# EAGLE design pixel-adapter (EAGLE 7.7.0)
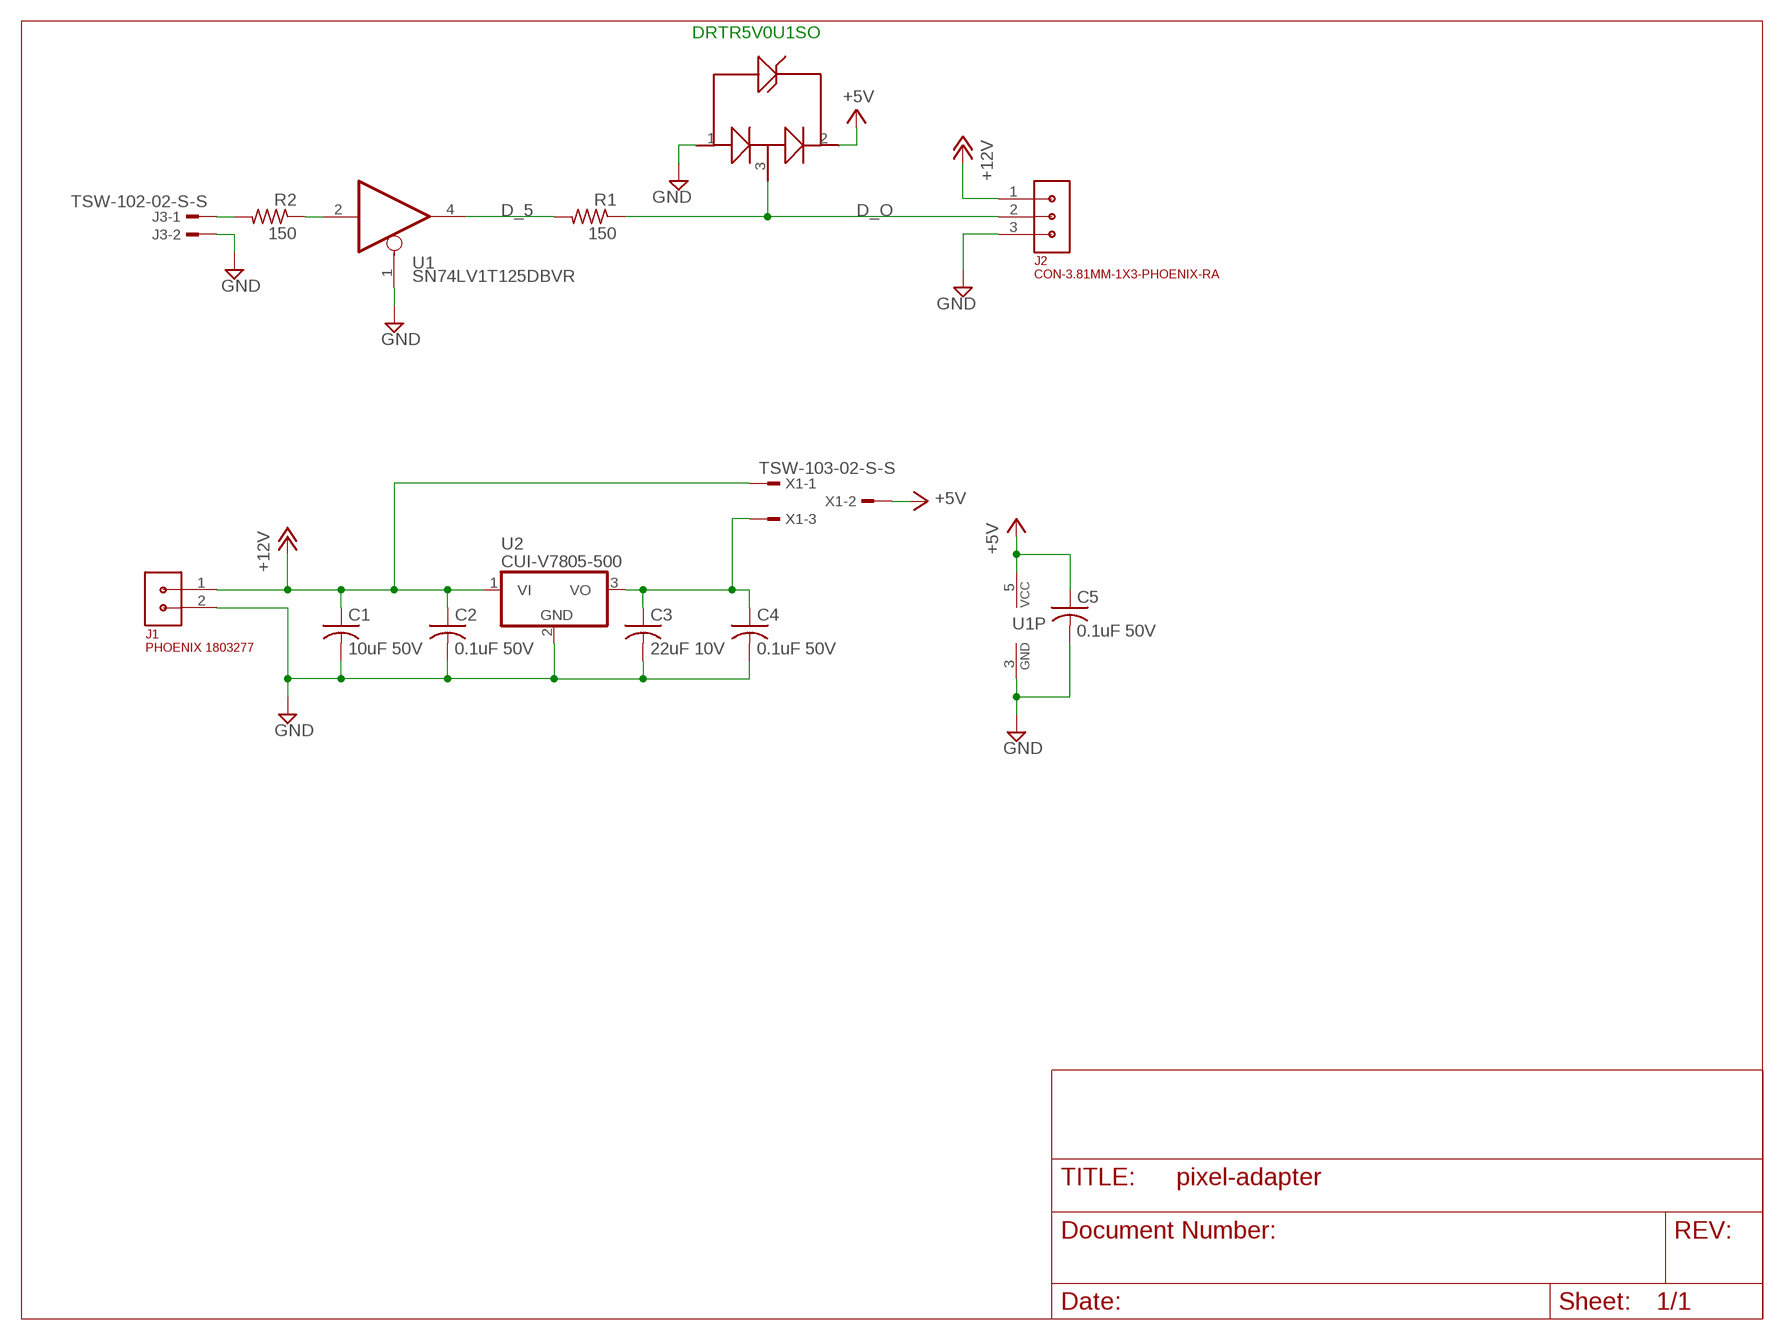
[diagram p0: schematic, sheet 1]

## Parts
C1  10uF 50V  C-USC1210K  [C1210K]
C2  0.1uF 50V  C-USC1206  [C1206]
C3  22uF 10V  C-USC1206K  [C1206K]
C4  0.1uF 50V  C-USC1206  [C1206]
C5  0.1uF 50V  C-USC0603K  [C0603K]
D1  DRTR5V0U1SO  [SOT23-3]
J1  PHOENIX 1803277  CON-3.81MM-1X2-PHOENIX  [CON-PHOENIX-3.81-1X2-RA]
J2  CON-3.81MM-1X3-PHOENIX-RA  [CON-PHOENIX-3.81-1X3-RA]
J3  TSW-102-02-S-S  [TSW-102-02-S-S]
R1  150  R-US_M1206  [M1206]
R2  150  R-US_M1206  [M1206]
U1  SN74LV1T125DBVR  74AHC1G125DBV  [SOT23-5]
U2  CUI-V7805-500  CUI-V7803-500  [CUI-78XX-500]
X1  TSW-103-02-S-S  [TSW-103-02-S-S]

## Nets
+5V: C5.1 D1.2 U1.5(VCC) X1.2
+12V: C1.1 C2.1 J1.1 J2.1 U2.1(VI) X1.1
D_5: R1.2 U1.4(O)
D_O: D1.3 J2.2 R1.1
DIN: J3.1 R2.2
DIN_O: R2.1 U1.2(I)
GND: C1.2 C2.2 C3.2 C4.2 C5.2 D1.1 J1.2 J2.3 J3.2 U1.1(OE) U1.3(GND) U2.2(GND)
VREG: C3.1 C4.1 U2.3(VO) X1.3

## Notes on the sheet
- DRTR5V0U1SO

## Library data of the parts
C1 = rcl:C-US: CAPACITOR, American symbol; MFR: KEMET; MFR_PART_NO: C1210C106K5RACTU
C2 C4 C5 = rcl:C-US: CAPACITOR, American symbol; MFR: KEMET; MFR_PART_NO: C1206S104M5RACTU
C3 = rcl:C-US: CAPACITOR, American symbol; MFR: KEMET; MFR_PART_NO: C1206C226K8RAC7800
D1 = GlenPartsLibrary:DRTR5V0U1SO
J1 = 0GlenConnectors:CON-3.81MM-1X2-PHOENIX
J2 = 0GlenConnectors:CON-3.81MM-1X3-PHOENIX-RA
J3 = con-samtec:TSW-102-02-S-S: THROUGH-HOLE .025" SQ POST HEADER Source: Samtec TSW.pdf; OC_FARNELL: unknown; OC_NEWARK: unknown
R1 R2 = rcl:R-US_: RESISTOR, American symbol
U1 = 74xx-little-us:74*1G125: Single Bus Buffer Gate with 3-State Output; MFR: TI; MFR_PART_NO: SN74LV1T125DBVR
U2 = GlenPartsLibrary:CUI-V7803-500
X1 = con-samtec:TSW-103-02-S-S: THROUGH-HOLE .025" SQ POST HEADER Source: Samtec TSW.pdf; OC_FARNELL: unknown; OC_NEWARK: unknown

## Board
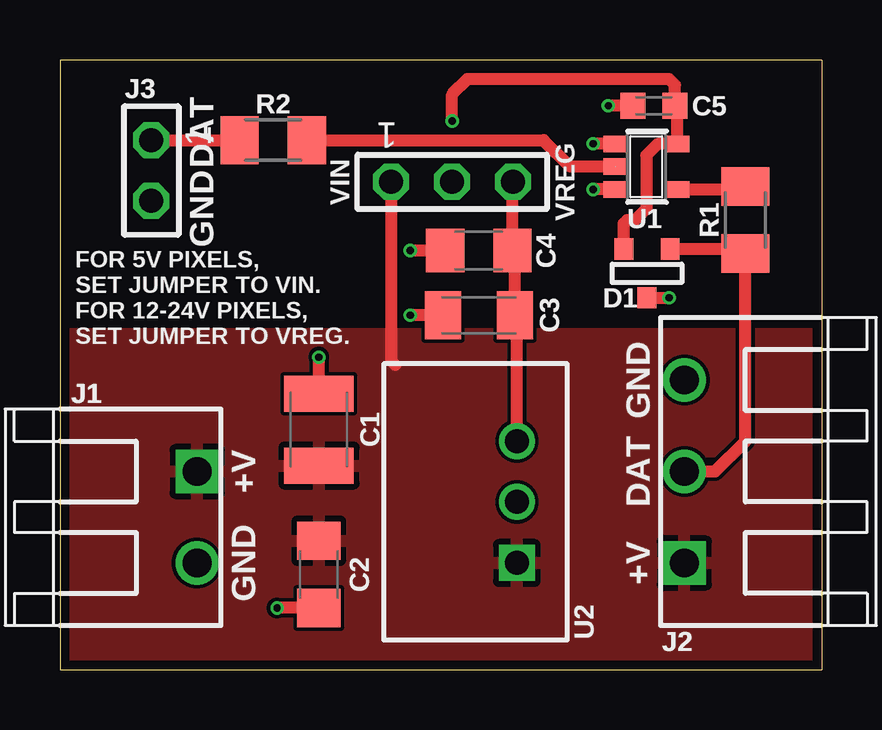
[diagram p1: board, top side]
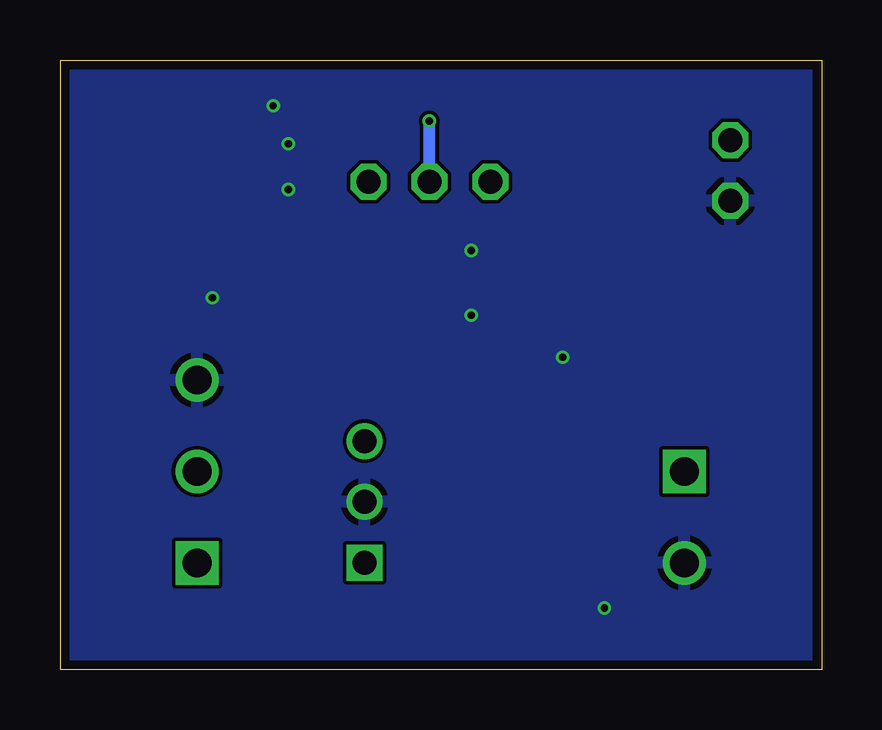
[diagram p2: board, bottom side, seen from below]

Size 31.75 x 25.4 mm. Coordinates in mm from the lower left corner, seen from the top.
Outline: 31.75,25.4 0,25.4 0,0 31.75,0 31.75,25.4
Copper layers (1*16): Top 0.035559375mm / dielectric 1.6mm / Bottom 0.035559375mm
Design rules "oshpark-2layer-2018": minimum track width 6mil, minimum drill 10mil, track to track 6mil, track to pad 6mil, pad to pad 6mil, via to via 6mil, smd to smd 6mil, copper to edge 15mil, drill to drill 6mil, minimum pad ring 5mil, minimum via ring 5mil, stop-mask expansion 2.5mil, vias tented up to drill 0mil, thermal gap 10mil

### Footprints (pad centres in the part's own frame; a part is rotated, then mirrored left to right if it is on the bottom)
C1210K = smd 1.5 x 2.9: 1 -1.5,0; 2 1.5,0
C1206 = smd 1.6 x 1.8: 1 -1.4,0; 2 1.4,0
C1206K = smd 1.5 x 2: 1 -1.5,0; 2 1.5,0
C0603K = smd 1.05 x 1.08: 1 -0.875,0; 2 0.875,0
SOT23-3 = smd 0.889 x 0.787: 1 1.016,0.025; 2 -1.016,-0.94; 3 -1.016,0.991
CON-PHOENIX-3.81-1X2-RA = drill 1.2 square: 1 0,0 | drill 1.2: 2 3.81,0
CON-PHOENIX-3.81-1X3-RA = drill 1.2 square: 1 0,0 | drill 1.2: 2 3.81,0; 3 7.62,0
TSW-102-02-S-S = drill 1 pad 1.5 octagon: 1 1.27,0; 2 -1.27,0
M1206 = smd 1.6 x 2: 1 -1.4,0; 2 1.4,0
SOT23-5 = smd 0.69 x 0.99: 1 -0.95,-1.29; 2 0,-1.29; 3 0.95,-1.29; 4 0.95,1.3; 5 -0.95,1.3
CUI-78XX-500 = drill 1 square: 1 0,0 | drill 1: 2 2.54,0; 3 5.08,0
TSW-103-02-S-S = drill 1 pad 1.5 octagon: 1 2.54,0; 2 0,0; 3 -2.54,0

### Placement (x,y rotation side)
C1  10.79,10 90 top
C2  10.79,3.97 270 top
C3  17.46,14.76 180 top
C4  17.46,17.46 180 top
C5  24.77,23.5 180 top
D1  24.45,16.51 270 top
J1  5.71,8.26 270 top
J2  26.04,4.45 90 top
J3  3.81,20.8 90 top
R1  28.57,18.73 90 top
R2  8.89,22.07 180 top
U1  24.45,20.95 270 top
U2  19.05,4.45 90 top
X1  16.35,20.32 180 top

### Tracks (layer width: path | path; a pad name or v marks a point on that pad's centre or on a via)
+5V  (via drill 0.3)
  Top 0.508: D1.2 23.51,18.59 23.65,18.73 23.97,18.73 24.45,19.21 24.45,21.43 24.92,21.91 U1.5 25.75,23.39 C5.1 25.64,24.37 25.4,24.61 16.99,24.61 16.35,23.97 v16.35,22.86
  Bottom 0.508: X1.2 v16.35,22.86
+12V
  Top 0.508: X1.1 13.81,12.86 13.97,12.7
  pour Top (isolate 0.152): 0,13.97 0,0 31.75,0 31.75,13.97
D_5
  Top 0.254: 28.47,20.23 R1.2
  Top 0.508: U1.4 28.45,20 R1.2
D_O
  Top 0.254: 28.38,17.53 R1.1
  Top 0.508: D1.3 28.38,17.53 | J2.2 27.3,8.26 28.57,9.53 R1.1
DIN
  Top 0.508: J3.1 R2.2
DIN_O
  Top 0.508: R2.1 20.16,22.07 21.27,20.95 U1.2
GND  (via drill 0.3)
  Top 0.508: D1.1 v25.4,15.49 | C4.2 v14.61,17.46 | C3.2 v14.61,14.76 | C1.2 v10.79,13.02 | C2.2 v9.05,2.57 | C5.2 v22.86,23.5 | U1.1 v22.23,21.91 | U1.3 v22.23,20
  pour Bottom (isolate 0.152): 0,25.4 0,0 31.75,0 31.75,25.4
VREG
  Top 0.508: U2.3 19.05,14.68 C3.1 18.96,17.36 C4.1 18.86,20.29 X1.3

### Text on the board
_tsilk: J3 | R2 | C5 | DAT | VIN | VREG | GND | U1 | R1 | FOR 5V PIXELS, / SET JUMPER TO VIN. / FOR 12-24V PIXELS, / SET JUMPER TO VREG. | C4 | D1 | C3 | GND | J1 | C1 | +V | DAT | GND | C2 | +V | J2 | U2